# EAGLE design R2020Interface-RS485 (EAGLE 6.3)
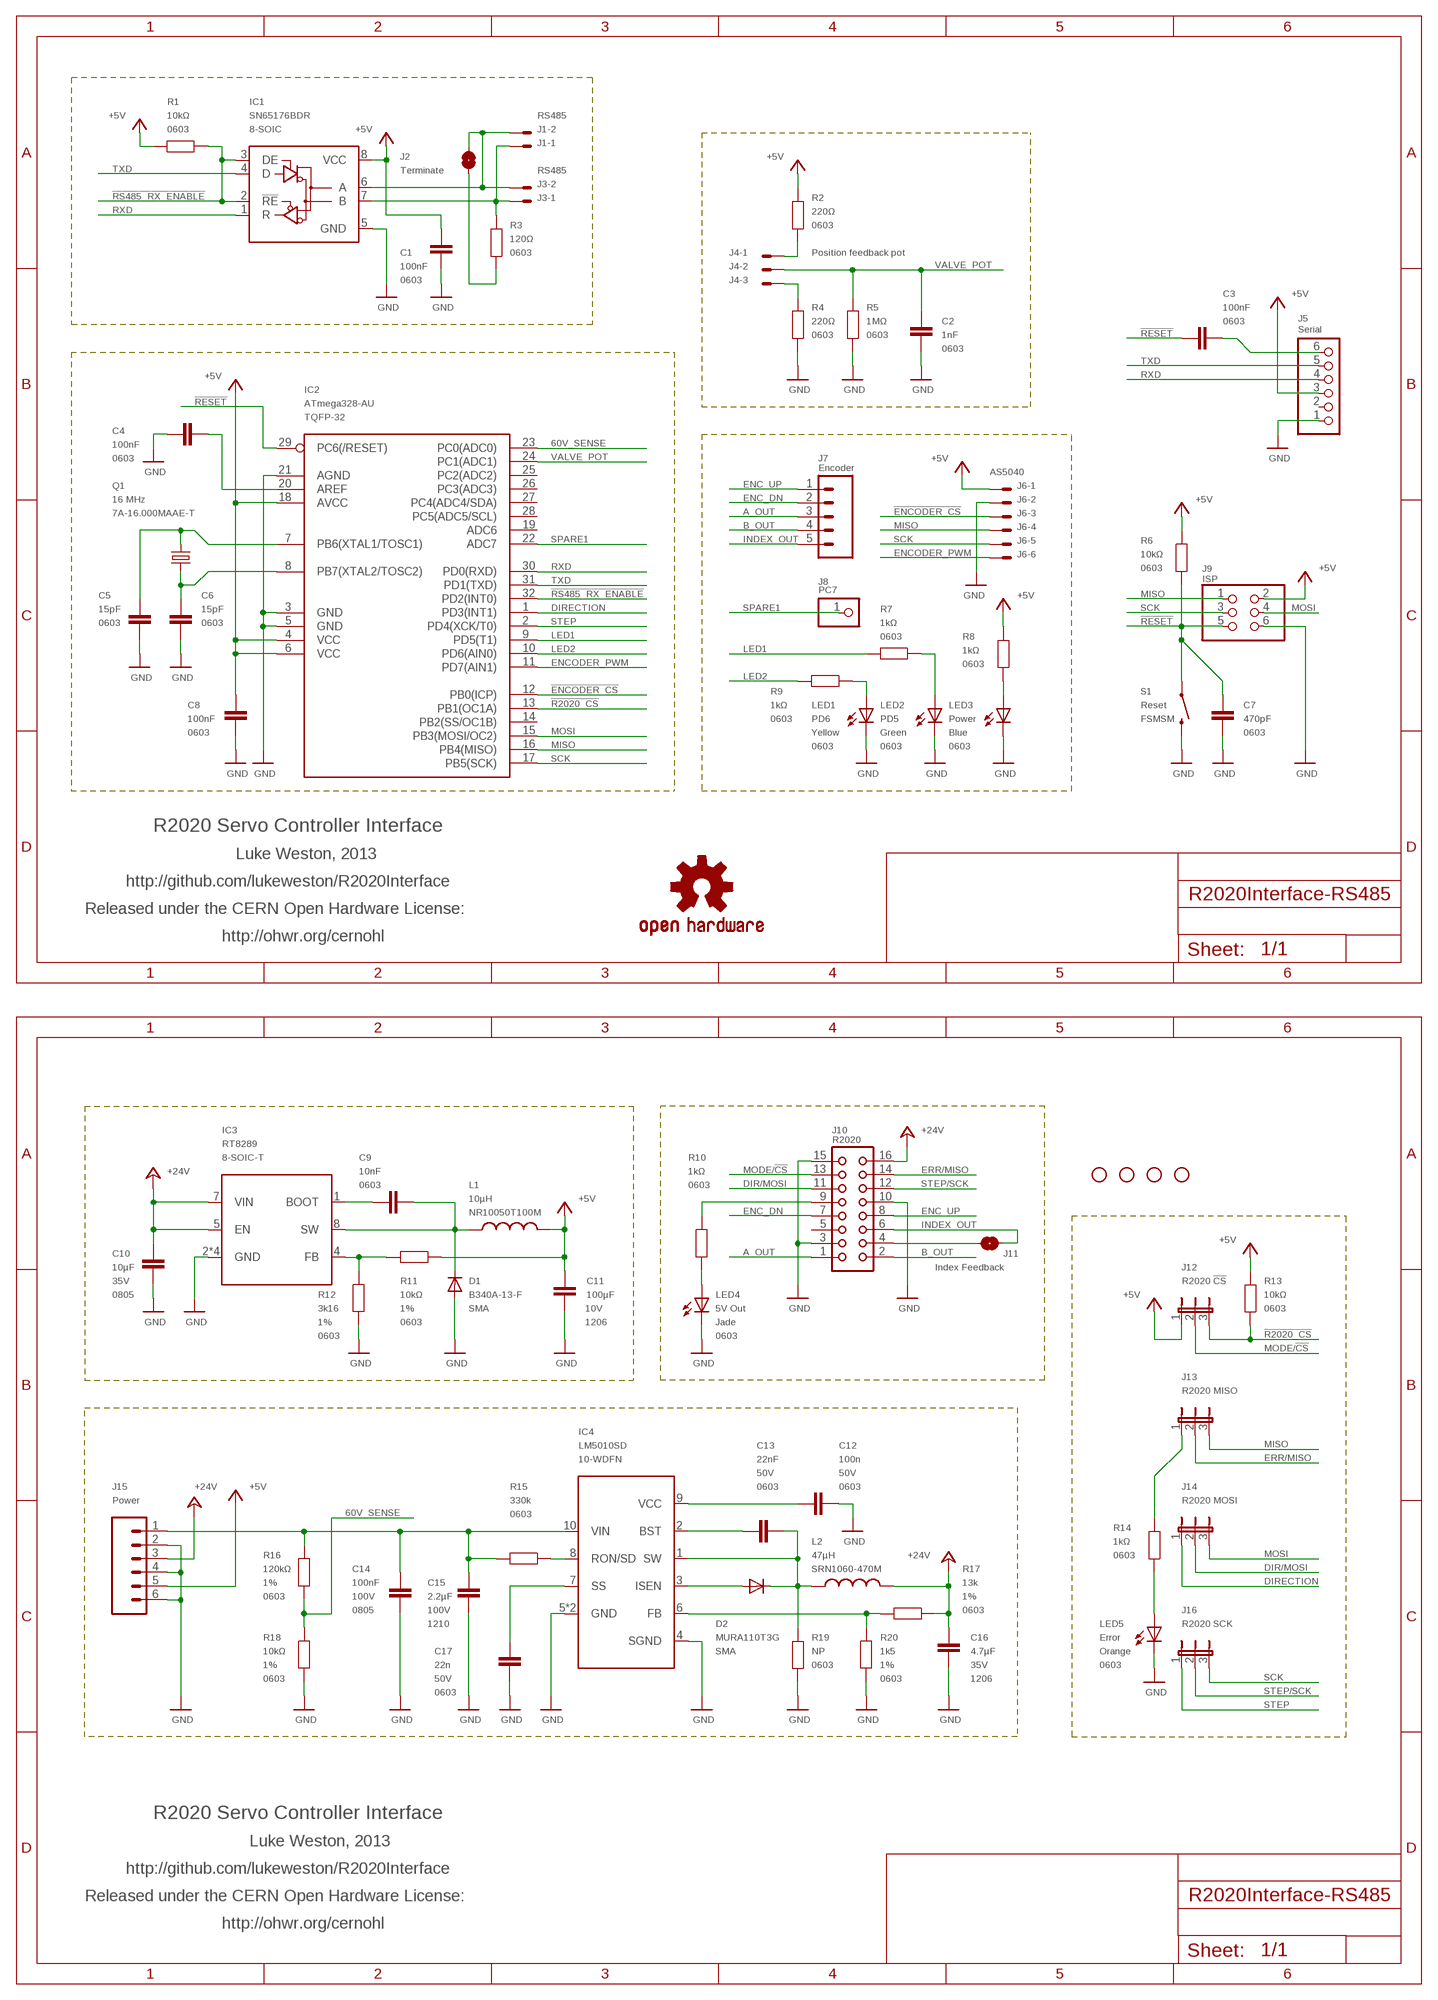
[diagram p0: schematic, sheet 1]

## Parts
C1  100nF  CAP0603  [0603]
C2  1nF  CAP0603  [0603]
C3  100nF  CAP0603  [0603]
C4  100nF  CAP0603  [0603]
C5  15pF  CAP0603  [0603]
C6  15pF  CAP0603  [0603]
C7  470pF  CAP0603  [0603]
C8  100nF  CAP0603  [0603]
C9  10nF  CAP0603  [0603]
C10  10µF  CAP0805  [0805]
C11  100µF  C-EUC1206K  [C1206K]
C12  100n  CAP0603  [0603]
C13  22nF  CAP0603  [0603]
C14  100nF  CAP0805  [0805]
C15  2.2µF  C-EUC1210K  [C1210K]
C16  4.7µF  C-EUC1206K  [C1206K]
C17  22n  CAP0603  [0603]
D1  B340A-13-F  DIODESMA  [SMA-DIODE]
D2  MURA110T3G  DIODESMA  [SMA-DIODE]
IC1  SN65176BDR  75176AD  [D_R-PDSO-G8]
IC2  ATmega328-AU  AVR-MEGA8-AI  [TQFP32-08]
IC3  RT8289  [SO08T]
IC4  LM5010SD  LM5010  [10-WSON]
J1  RS485  22-05-7028-02  [7395-02]
J2  Terminate  SJ  [SJ]
J3  RS485  22-05-7028-02  [7395-02]
J4  Position feedback pot  22-05-7038-03  [7395-03]
J5  Serial  PINHD-1X6  [1X06]
J6  AS5040  22-05-7068-06  [7395-06]
J7  Encoder  M05PTH  [1X05]
J8  PC7  PINHD-1X1  [1X01]
J9  ISP  PINHD-2X3  [2X03]
J10  R2020  CON16  [CON16]
J11  Index Feedback  SJ  [SJ]
J12  R2020 !CS  JP2E  [JP2]
J13  R2020 MISO  JP2E  [JP2]
J14  R2020 MOSI  JP2E  [JP2]
J15  Power  M06  [TERMINALBLOCK_3.5MM_6]
J16  R2020 SCK  JP2E  [JP2]
JP1  STAND-OFF  [STAND-OFF]
JP2  STAND-OFF  [STAND-OFF]
JP3  STAND-OFF  [STAND-OFF]
JP4  STAND-OFF  [STAND-OFF]
L1  10µH  NR10050  [NR10050]
L2  47µH  SRN1060  [SRN1060]
LED1  PD6  LED0603  [LED-0603]
LED2  PD5  LED0603  [LED-0603]
LED3  Power  LED0603  [LED-0603]
LED4  5V Out  LED0603  [LED-0603]
LED5  Error  LED0603  [LED-0603]
Q1  16 MHz  CRYSTAL-2LEAD3.2X5  [CRYSTAL-3.2X5MM]
R1  10kΩ  RESISTOR0603  [0603]
R2  220Ω  RESISTOR0603  [0603]
R3  120Ω  RESISTOR0603  [0603]
R4  220Ω  RESISTOR0603  [0603]
R5  1MΩ  RESISTOR0603  [0603]
R6  10kΩ  RESISTOR0603  [0603]
R7  1kΩ  RESISTOR0603  [0603]
R8  1kΩ  RESISTOR0603  [0603]
R9  1kΩ  RESISTOR0603  [0603]
R10  1kΩ  RESISTOR0603  [0603]
R11  10kΩ  RESISTOR0603  [0603]
R12  3k16  RESISTOR0603  [0603]
R13  10kΩ  RESISTOR0603  [0603]
R14  1kΩ  RESISTOR0603  [0603]
R15  330k  RESISTOR0603  [0603]
R16  120kΩ  RESISTOR0603  [0603]
R17  13k  RESISTOR0603  [0603]
R18  10kΩ  RESISTOR0603  [0603]
R19  NP  RESISTOR0603  [0603]
R20  1k5  RESISTOR0603  [0603]
S1  Reset  FSMSM  [FSMSM]
SY1  OSHW-LOGOS  [OSHW-LOGO-S]

## Nets
60V_SENSE: IC2.23(PC0(ADC0)) R16.1 R18.2
!ENCODER_CS: IC2.12(PB0(ICP)) J6.3
!R2020_CS: IC2.13(PB1(OC1A)) J12.3 R13.2
!RESET: C3.1 C7.2 IC2.29(PC6(/RESET)) J9.5 R6.1 S1.1
!RS485_RX_ENABLE: IC1.2(!RE) IC1.3(DE) IC2.32(PD2(INT0)) R1.2
+5V: C1.2 C8.1 C11.1 IC1.8(VCC) IC2.4(VCC) IC2.6(VCC) IC2.18(AVCC) J5.3 J6.1 J9.2 J12.1 J15.5 L1.2 R1.1 R2.1 R6.2 R8.1 R11.1 R13.1
+24V: C10.2 C16.1 IC3.5(EN) IC3.7(VIN) J10.16 J15.3 L2.2 R17.1
A_OUT: J7.3 J10.1
B_OUT: J7.4 J10.2
DIR/MOSI: J10.11 J14.2
DIRECTION: IC2.1(PD3(INT1)) J14.1
ENC_DN: J7.2 J10.7
ENC_UP: J7.1 J10.8
ENCODER_PWM: IC2.11(PD7(AIN1)) J6.6
ERR/MISO: J10.14 J13.2
GND: C1.1 C2.1 C4.2 C5.1 C6.1 C7.1 C8.2 C10.1 C11.2 C12.1 C14.1 C15.2 C16.2 C17.1 D1.A IC1.5(GND) IC2.3(GND) IC2.5(GND) IC2.21(AGND) IC3.2(GND) IC3.3(GND) IC3.6(GND) IC3.PAD(GND) IC4.4(SGND) IC4.5(GND) IC4.PAD(GND) J5.1 J6.2 J9.6 J10.3 J10.10 J10.15 J15.2 J15.4 J15.6 LED1.C LED2.C LED3.C LED4.C LED5.C R4.2 R5.2 R12.1 R18.1 R19.2 R20.1 S1.2
INDEX_IN: J10.4 J11.2
INDEX_OUT: J7.5 J10.6 J11.1
LED1: IC2.9(PD5(T1)) R7.2
LED2: IC2.10(PD6(AIN0)) R9.2
MISO: IC2.16(PB4(MISO)) J6.4 J9.1 J13.3
MODE/!CS: J10.13 J12.2
MOSI: IC2.15(PB3(MOSI/OC2)) J9.4 J14.3
N$1: C4.1 IC2.20(AREF)
N$2: C5.2 IC2.7(PB6(XTAL1/TOSC1)) Q1.1
N$3: C6.2 IC2.8(PB7(XTAL2/TOSC2)) Q1.2
N$4: LED4.A R10.1
N$5: J10.9 R10.2
N$6: J4.1 R2.2
N$7: J13.1 R14.1
N$8: IC1.6(A) J1.2 J2.2 J3.2
N$9: J4.3 R4.1
N$10: LED5.A R14.2
N$11: C9.1 D1.C IC3.8(SW) L1.1
N$12: IC1.7(B) J1.1 J3.1 R3.1
N$13: LED1.A R9.1
N$14: IC3.4(FB) R11.2 R12.2
N$15: LED2.A R7.1
N$16: C9.2 IC3.1(BOOT)
N$17: C13.1 D2.C IC4.1(SW) L2.1 R19.1
N$18: J2.1 R3.2
N$19: D2.A IC4.3(ISEN)
N$20: IC4.6(FB) R17.2 R20.2
N$21: C17.2 IC4.7(SS)
N$22: IC4.8(RON/SD) R15.1
N$25: C12.2 IC4.9(VCC)
N$26: C3.2 J5.6
N$27: C13.2 IC4.2(BST)
N$28: LED3.A R8.2
N$36: C14.2 C15.1 IC4.10(VIN) J15.1 R15.2 R16.2
RXD: IC1.1(R) IC2.30(PD0(RXD)) J5.4
SCK: IC2.17(PB5(SCK)) J6.5 J9.3 J16.3
SPARE1: IC2.22(ADC7) J8.1
STEP: IC2.2(PD4(XCK/T0)) J16.1
STEP/SCK: J10.12 J16.2
TXD: IC1.4(D) IC2.31(PD1(TXD)) J5.5
VALVE_POT: C2.2 IC2.24(PC1(ADC1)) J4.2 R5.1
Unconnected: IC2.14(PB2(SS/OC1B)) IC2.19(ADC6) IC2.25(PC2(ADC2)) IC2.26(PC3(ADC3)) IC2.27(PC4(ADC4/SDA)) IC2.28(PC5(ADC5/SCL)) J5.2 J10.5

## Notes on the sheet
- R2020 Servo Controller Interface
- Luke Weston, 2013
- http://github.com/lukeweston/R2020Interface
- Released under the CERN Open Hardware License:
- http://ohwr.org/cernohl
- R2020 Servo Controller Interface
- Luke Weston, 2013
- http://github.com/lukeweston/R2020Interface
- Released under the CERN Open Hardware License:
- http://ohwr.org/cernohl

## Library data of the parts
C1-C9 = freetronics-master-v1:CAP: Capacitor Standard 0603 ceramic capacitor, and 0.1" leaded capacitor.; PACKAGE: 0603
C10 = freetronics-master-v1:CAP: Capacitor Standard 0603 ceramic capacitor, and 0.1" leaded capacitor.; PACKAGE: 0805; VOLTAGE: 35V
C11 = rcl:C-EU: CAPACITOR, European symbol; PACKAGE: 1206; VOLTAGE: 10V
C12 C13 C17 = freetronics-master-v1:CAP: Capacitor Standard 0603 ceramic capacitor, and 0.1" leaded capacitor.; PACKAGE: 0603; VOLTAGE: 50V
C14 = freetronics-master-v1:CAP: Capacitor Standard 0603 ceramic capacitor, and 0.1" leaded capacitor.; PACKAGE: 0805; VOLTAGE: 100V
C15 = rcl:C-EU: CAPACITOR, European symbol; PACKAGE: 1210; VOLTAGE: 100V
C16 = rcl:C-EU: CAPACITOR, European symbol; PACKAGE: 1206; VOLTAGE: 35V
D1 D2 = freetronics-master-v1:DIODE: Diode These are standard reverse protection diodes and small signal diodes. SMA package can handle up to about 1A. SOD-323 can handle about 200mA. What the SOD-323 package when ordering, there are some mfgs out there that are 5-pin packages.; PACKAGE: SMA
IC1 = 751xx:75176A: DIFFERENTIAL BUS TRANSCEIVER Source: http://focus.ti.com/lit/ds/symlink/sn75176a.pdf; PACKAGE: 8-SOIC
IC2 = freetronics-master-v1:AVR-MEGA8: MICROCONTROLLER 8 Kbytes FLASH 1 kbytes SRAM 512 bytes EEPROM USART 6-channel 10 bit ADC 2-channel 8 bit ADC; PACKAGE: TQFP-32
IC3 = freetronics-luke:RT8289: RT8289 buck regulator; PACKAGE: 8-SOIC-T
IC4 = freetronics-luke:LM5010: Texas Instruments LM5010 high-voltage-input buck converter; PACKAGE: 10-WDFN
J1 J3 = con-molex:22-?-02: CONNECTOR wire to board 2.54 mm (.1 inch) pitch header; OC_FARNELL: 9731601; OC_NEWARK: unknown
J2 J11 = freetronics-luke:SJ: PCB "solder jumper". Note that there should nothing on the BOM corresponding to this "component".
J4 = con-molex:22-?-03: CONNECTOR wire to board 2.54 mm (.1 inch) pitch header; OC_FARNELL: unknown; OC_NEWARK: unknown
J5 = pinhead:PINHD-1X6: PIN HEADER
J6 = con-molex:22-?-06: CONNECTOR wire to board 2.54 mm (.1 inch) pitch header; OC_FARNELL: unknown; OC_NEWARK: unknown
J7 = freetronics-master-v1:M05: Header 5 Standard 5-pin 0.1" header. Use with straight break away headers (SKU : PRT-00116), right angle break away headers (PRT-00553), swiss pins (PRT-00743), machine pins (PRT-00117), and female headers (PRT-00115). Molex polarized connector foot print use with SKU : PRT-08230 with associated crimp pins and housings.
J8 = pinhead:PINHD-1X1: PIN HEADER
J9 = pinhead:PINHD-2X3: PIN HEADER
J10 = con-harting:CON16: CONNECTOR; OC_FARNELL: unknown; OC_NEWARK: unknown
J12-J14 J16 = jumper:JP2E: JUMPER
J15 = freetronics-master-v1:M06: Header 6 Standard 6-pin 0.1" header. Use with straight break away headers (SKU : PRT-00116), right angle break away headers (PRT-00553), swiss pins (PRT-00743), machine pins (PRT-00117), and female headers (PRT-00115). Molex polarized connector foot print use with SKU : PRT-08094 with associated crimp pins and housings. NOTES ON THE VARIANTS LOCK and LOCK_LONGPADS... This footprint was designed to help hold the alignment of a through-hole component (i.e. 6-pin header) while soldering it into place. You may notice that each hole has been shifted either up or down by 0.005 of an inch from it's more standard position (which is a perfectly straight line). This slight alteration caused the pins (the squares in the middle) to touch the edges of the holes. Because they are alternating, it causes a "brace" to hold the component in place. 0.005 has proven to be the perfect amount of "off-center" position when using our standard breakaway headers. Although looks a little odd when you look at the bare footprint, once you have a header in there, the alteration is very hard to notice. Also, if you push a header all the way into place, it is covered up entirely on the bottom side. This idea of altering the position of holes to aid alignment will be further integrated into the Sparkfun Library for other footprints. It can help hold any component with 3 or more connection pins.
JP1-JP4 = SparkFun:STAND-OFF: Stand Off This is the mechanical footprint for a #4 phillips button head screw. Use the keepout ring to avoid running the screw head into surrounding components. SKU : PRT-00447
L1 = freetronics-luke:NR10050: Taiyo Yuden NR10050 SMD power inductors; ID: NR10050T100M
L2 = freetronics-luke:SRN1060: Bourns SRN1060 series SMD power inductors; ID: SRN1060-470M
LED1 = freetronics-master-v1:LED: LEDs Standard schematic elements and footprints for 5mm, 3mm, 1206, and 0603 sized LEDs. 5mm - Spark Fun Electronics SKU : COM-00529 (and others); COLOR: Yellow; PACKAGE: 0603
LED2 = freetronics-master-v1:LED: LEDs Standard schematic elements and footprints for 5mm, 3mm, 1206, and 0603 sized LEDs. 5mm - Spark Fun Electronics SKU : COM-00529 (and others); COLOR: Green; PACKAGE: 0603
LED3 = freetronics-master-v1:LED: LEDs Standard schematic elements and footprints for 5mm, 3mm, 1206, and 0603 sized LEDs. 5mm - Spark Fun Electronics SKU : COM-00529 (and others); COLOR: Blue; PACKAGE: 0603
LED4 = freetronics-master-v1:LED: LEDs Standard schematic elements and footprints for 5mm, 3mm, 1206, and 0603 sized LEDs. 5mm - Spark Fun Electronics SKU : COM-00529 (and others); COLOR: Jade; PACKAGE: 0603
LED5 = freetronics-master-v1:LED: LEDs Standard schematic elements and footprints for 5mm, 3mm, 1206, and 0603 sized LEDs. 5mm - Spark Fun Electronics SKU : COM-00529 (and others); COLOR: Orange; PACKAGE: 0603
Q1 = freetronics-luke:CRYSTAL-2LEAD: 2-lead SMD crystal; ID: 7A-16.000MAAE-T
R1-R10 R13-R15 R19 = freetronics-master-v1:RESISTOR: Resistor Basic schematic elements and footprints for 0603, 1206, and PTH 1/10th watt (small) resistors.; PACKAGE: 0603
R11 R12 R16-R18 R20 = freetronics-master-v1:RESISTOR: Resistor Basic schematic elements and footprints for 0603, 1206, and PTH 1/10th watt (small) resistors.; PACKAGE: 0603; TOLERANCE: 1%
S1 = freetronics-luke:FSMSM: Tyco FSMSM 2-pin SMD small tactile button; PACKAGE: FSMSM
SY1 = SparkFun:OSHW-LOGO: Open Source Hardware Logo This logo indicates the piece of hardware it is found on incorporates a OSHW license and/or adheres to the definition of open source hardware found here: http://freedomdefined.org/OSHW

## Net classes
0 default: width 0.152 mm, drill 0.241 mm, clearance 0.152 mm

## Board
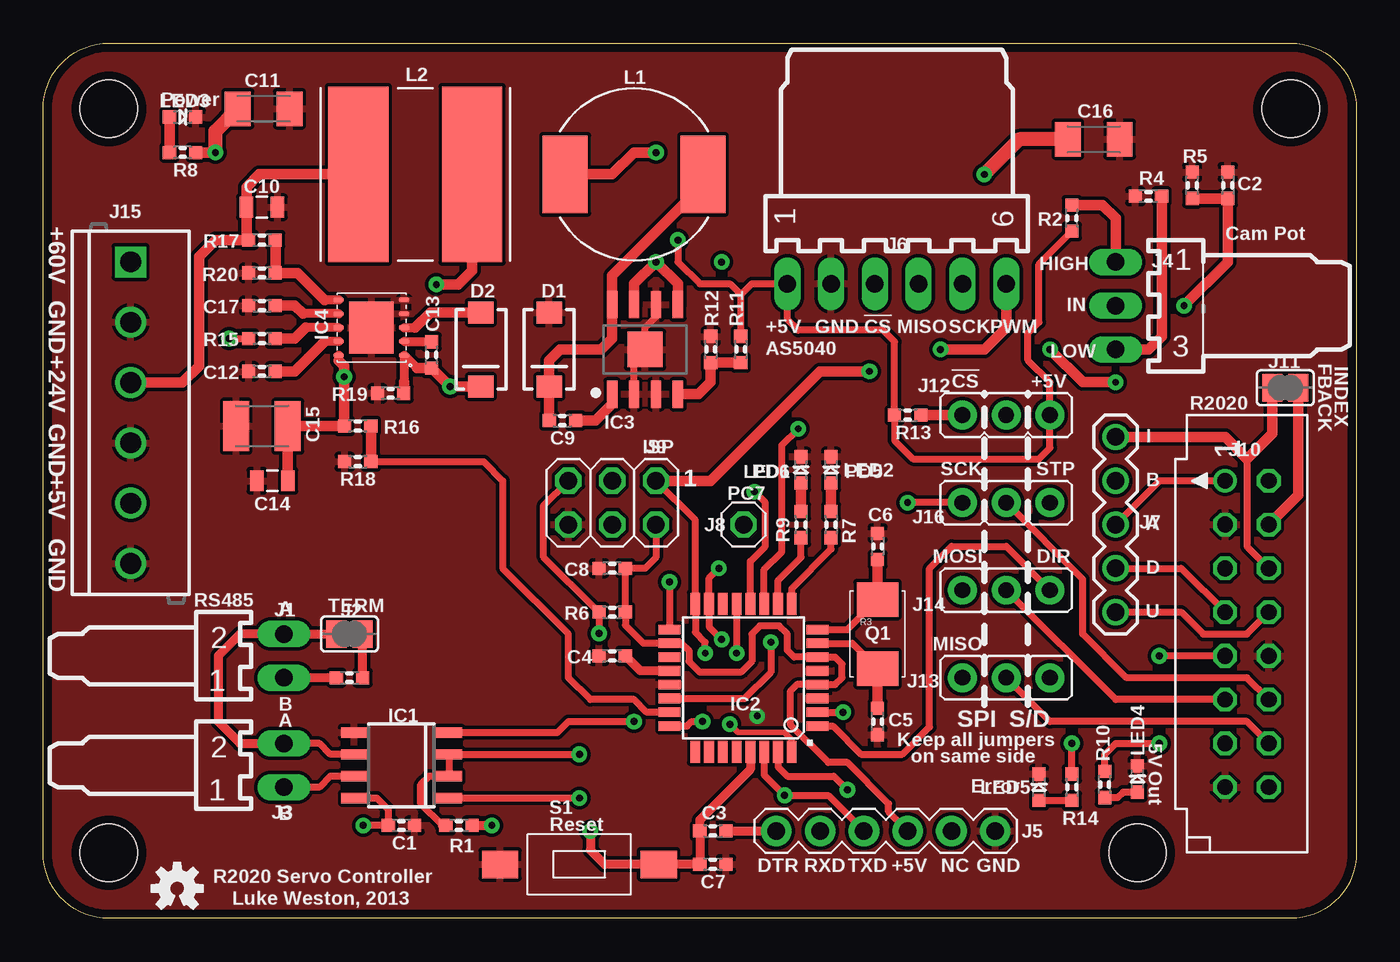
[diagram p1: board, top side]
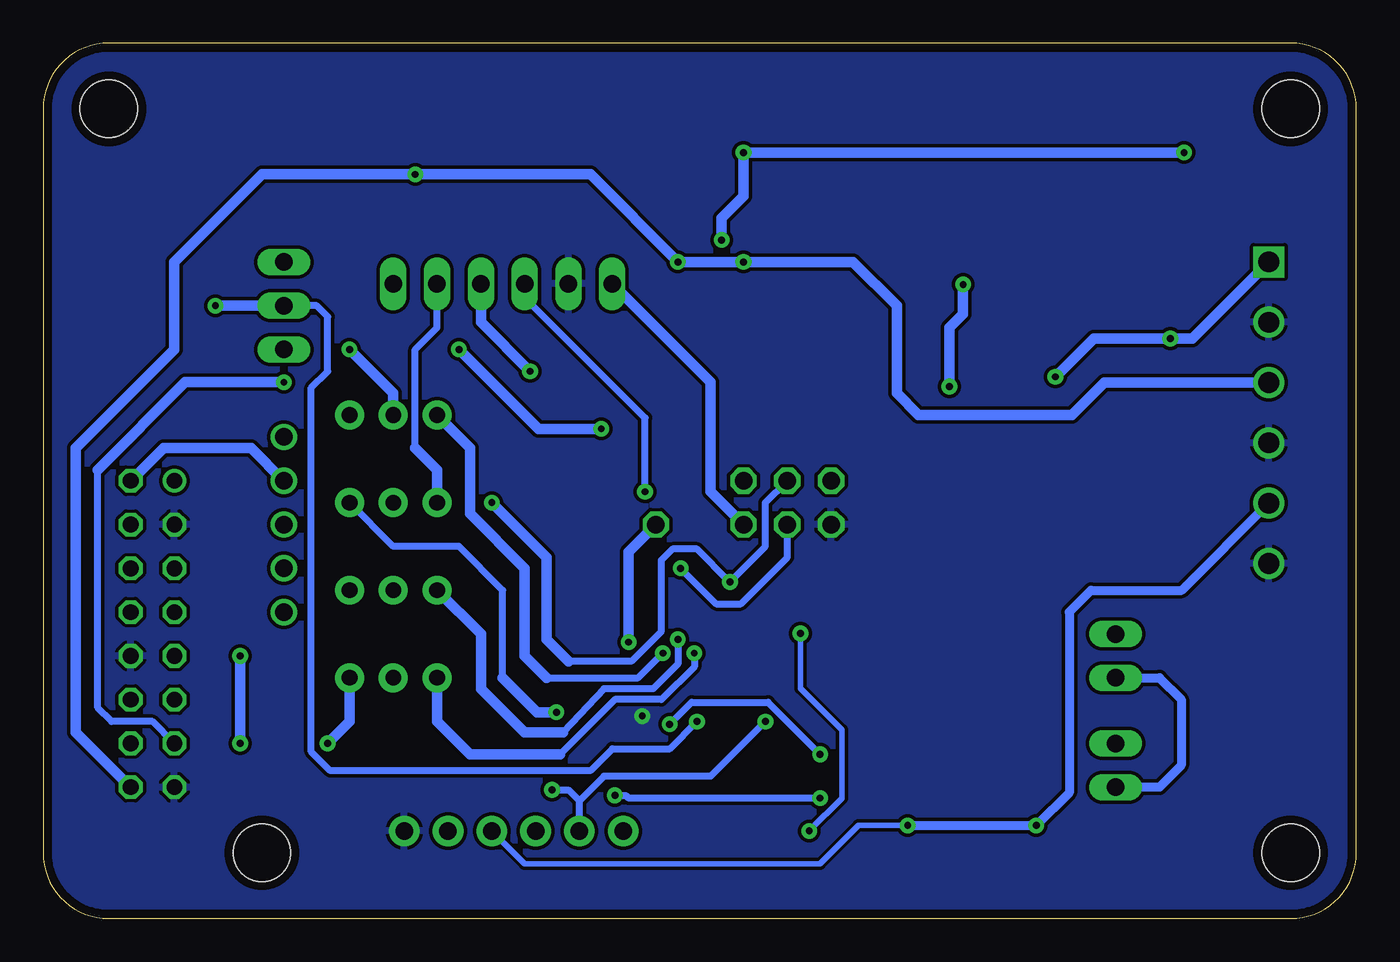
[diagram p2: board, bottom side, seen from below]

Size 76.2 x 50.8 mm. Coordinates in mm from the lower left corner, seen from the top.
Outline: 0,46.99 arc-90 3.81,50.8 72.39,50.8 arc-90 76.2,46.99 76.2,3.81 arc-90 72.39,0 3.81,0 arc-90 0,3.81 0,46.99
Copper layers (1*16): Top 0.035mm / dielectric 1.5mm / Bottom 0.035mm
Design rules "PCBCart-Standard *": minimum track width 8mil, minimum drill 0.4mm, track to track 8mil, track to pad 8mil, pad to pad 8mil, via to via 8mil, smd to smd 8mil, copper to edge 20mil, drill to drill 8mil, minimum pad ring 8mil, minimum via ring 10mil, stop-mask expansion 3mil, vias tented up to drill 16mil, thermal gap 8mil

### Footprints (pad centres in the part's own frame; a part is rotated, then mirrored left to right if it is on the bottom)
0603 = smd 0.762 x 0.762: 1 -0.762,0; 2 0.762,0
0805 = smd 0.8 x 1.2: 1 -0.9,0; 2 0.9,0
C1206K = smd 1.5 x 2: 1 -1.5,0; 2 1.5,0
C1210K = smd 1.5 x 2.9: 1 -1.5,0; 2 1.5,0
SMA-DIODE = smd 1.27 x 1.47: A -2.15,0; C 2.15,0
D_R-PDSO-G8 = smd 0.6 x 1.5: 1 -1.905,-2.75; 2 -0.635,-2.75; 3 0.635,-2.75; 4 1.905,-2.75; 5 1.905,2.75; 6 0.635,2.75; 7 -0.635,2.75; 8 -1.905,2.75
TQFP32-08 = smd 1.27 x 0.559: 1 -4.293,2.8; 2 -4.293,2; 3 -4.293,1.2; 4 -4.293,0.4; 5 -4.293,-0.4; 6 -4.293,-1.2; 7 -4.293,-2; 8 -4.293,-2.8; 17 4.293,-2.8; 18 4.293,-2; 19 4.293,-1.2; 20 4.293,-0.4; 21 4.293,0.4; 22 4.293,1.2; 23 4.293,2; 24 4.293,2.8 | smd 0.559 x 1.27: 9 -2.8,-4.293; 10 -2,-4.293; 11 -1.2,-4.293; 12 -0.4,-4.293; 13 0.4,-4.293; 14 1.2,-4.293; 15 2,-4.293; 16 2.8,-4.293; 25 2.8,4.293; 26 2,4.293; 27 1.2,4.293; 28 0.4,4.293; 29 -0.4,4.293; 30 -1.2,4.293; 31 -2,4.293; 32 -2.8,4.293
SO08T = smd 0.6 x 1.575: 1 -1.905,-2.6; 2 -0.635,-2.6; 3 0.635,-2.6; 4 1.905,-2.6; 5 1.905,2.6; 6 0.635,2.6; 7 -0.635,2.6; 8 -1.905,2.6 | smd 2.057 x 2.057: PAD 0,0
10-WSON = smd 0.3 x 0.6: 1 -1.6,-1.9; 2 -0.8,-1.9; 3 0,-1.9; 4 0.8,-1.9; 5 1.6,-1.9; 6 1.6,1.9; 7 0.8,1.9; 8 0,1.9; 9 -0.8,1.9; 10 -1.6,1.9 | smd 3 x 2.6: PAD 0,0
7395-02 = drill 1.016 long: 1 1.27,0; 2 -1.27,0
SJ = smd 1.168 x 1.6: 1 -0.762,0; 2 0.762,0
7395-03 = drill 1.016 long: 1 2.54,0; 2 0,0; 3 -2.54,0
1X06 = drill 1.016 pad 1.778: 1 -6.35,0; 2 -3.81,0; 3 -1.27,0; 4 1.27,0; 5 3.81,0; 6 6.35,0
7395-06 = drill 1.016 long: 1 6.35,0; 2 3.81,0; 3 1.27,0; 4 -1.27,0; 5 -3.81,0; 6 -6.35,0
1X05 = drill 1.016: 1 0,0; 2 2.54,0; 3 5.08,0; 4 7.62,0; 5 10.16,0
1X01 = drill 1.016 octagon: 1 0,0
2X03 = drill 1.016 octagon: 1 -2.54,-1.27; 2 -2.54,1.27; 3 0,-1.27; 4 0,1.27; 5 2.54,-1.27; 6 2.54,1.27
CON16 = drill 0.914: 1 -8.89,-1.27 | drill 0.914 octagon: 2 -8.89,1.27; 3 -6.35,-1.27; 4 -6.35,1.27; 5 -3.81,-1.27; 6 -3.81,1.27; 7 -1.27,-1.27; 8 -1.27,1.27; 9 1.27,-1.27; 10 1.27,1.27; 11 3.81,-1.27; 12 3.81,1.27; 13 6.35,-1.27; 14 6.35,1.27; 15 8.89,-1.27; 16 8.89,1.27
JP2 = drill 0.914 pad 1.676: 1 -2.54,0; 2 0,0; 3 2.54,0
TERMINALBLOCK_3.5MM_6 = drill 1.2 square: 1 0,0 | drill 1.2: 2 3.5,0; 3 7,0; 4 10.5,0; 5 14,0; 6 17.5,0
STAND-OFF = hole 3.302: 0,0
NR10050 = smd 2.6 x 4.5: 1 -4,0; 2 4,0
SRN1060 = smd 3.5 x 10.2: 1 -3.3,0; 2 3.3,0
LED-0603 = smd 0.762 x 0.762: A -0.762,0; C 0.762,0
CRYSTAL-3.2X5MM = smd 2 x 2.4: 1 -2,0; 2 2,0
FSMSM = smd 2.108 x 1.6: 1 -4.597,0; 2 4.597,0

### Placement (x,y rotation side)
C1  20.8,5.4 180 top
C2  68.74,42.55 270 top
C3  38.86,5.08 0 top
C4  33.02,15.24 180 top
C5  48.42,11.43 90 top
C6  48.42,21.59 270 top
C7  38.86,3.14 180 top
C8  33.02,20.32 180 top
C9  30.13,28.89 0 top
C10  12.7,41.27 180 top
C11  12.8,46.99 0 top
C12  12.7,31.75 0 top
C13  22.54,32.7 90 top
C14  13.31,25.4 0 top
C15  12.7,28.57 180 top
C16  60.96,45.21 0 top
C17  12.7,35.56 0 top
D1  29.37,33.02 270 top
D2  25.4,33.02 270 top
IC1  20.8,8.89 90 top
IC2  40.64,13.97 180 top
IC3  34.92,33.02 0 top
IC4  19.05,34.29 90 top
J1  13.97,15.24 270 top
J2  17.78,16.51 180 top
J3  13.97,8.89 270 top
J4  62.23,35.56 90 top
J5  48.9,5.08 180 top
J6  49.53,36.83 180 top
J7  62.23,17.78 90 top
J8  40.64,22.86 0 top
J9  33.02,24.13 180 top
J10  69.85,16.51 270 top
J11  72.07,30.8 0 top
J12  55.88,29.21 180 top
J13  55.88,13.97 180 top
J14  55.88,19.05 180 top
J15  5.08,38.1 270 top
J16  55.88,24.13 180 top
JP1  72.39,46.99 0 top
JP2  63.5,3.81 0 top
JP3  3.81,46.99 0 top
JP4  3.81,3.81 0 top
L1  34.29,43.18 180 top
L2  21.59,43.18 180 top
LED1  43.97,26.04 90 top
LED2  45.72,26.04 90 top
LED3  8.1,46.51 0 top
LED4  63.5,8.1 90 top
LED5  57.78,7.62 90 top
Q1  48.42,16.51 90 top
R1  24.13,5.4 180 top
R2  59.69,40.64 90 top
R3  17.78,13.97 0 top
R4  64.14,41.91 180 top
R5  66.67,42.55 90 top
R6  33.02,17.78 0 top
R7  45.72,22.86 270 top
R8  8.1,44.45 180 top
R9  43.97,22.86 270 top
R10  61.59,7.78 90 top
R11  40.48,33.02 270 top
R12  38.73,33.02 270 top
R13  50.16,29.21 0 top
R14  59.69,7.62 270 top
R15  12.7,33.66 180 top
R16  18.26,28.57 180 top
R17  12.7,39.37 0 top
R18  18.26,26.51 0 top
R19  20.16,30.48 180 top
R20  12.7,37.47 0 top
S1  31.11,3.14 180 top
SY1  7.78,1.75 0 top

### Tracks (layer width: path | path; a pad name or v marks a point on that pad's centre or on a via)
60V_SENSE
  Top 0.406: IC2.23 35.02,11.97 34.29,12.7 31.75,12.7 30.48,13.97 30.48,16.51 26.67,20.32 26.67,25.4 25.56,26.51 R18.2
  Top 0.61: R16.1 R18.2
!ENCODER_CS  (via drill 0.4)
  Top 0.406: IC2.12 41.04,20.72 41.91,21.59 41.91,24.13 v41.27,24.77
  Bottom 0.406: v41.27,24.77 41.27,29.05 48.26,36.04 J6.3
!R2020_CS  (via drill 0.4)
  Top 0.406: IC2.13 v40.24,15.4
  Top 0.61: R13.2 J12.3
  Bottom 0.406: 46.99,13.97 41.67,13.97 v40.24,15.4
  Bottom 0.61: J12.3 51.44,27.3 51.44,23.5 48.26,20.32 48.26,15.24 46.99,13.97
!RESET  (via drill 0.4)
  Top 0.406: v32.26,16.54 R6.1 32.26,17.91 32.1,17.91 29.05,20.95 29.05,23.97 J9.5
  Top 0.508: IC2.29 41.04,8.65 38.1,5.71 C3.1 C7.2 S1.1 32.58,3.14 31.75,3.97 v31.75,5.08
  Bottom 0.305: v32.26,16.54 32.26,13.37 29.84,10.95 29.84,6.99 v31.75,5.08
!RS485_RX_ENABLE  (via drill 0.4)
  Top 0.305: IC2.32 43.44,10.38 43.02,10.79 40.32,10.79 v39.85,11.27
  Top 0.406: 23.18,5.4 21.91,6.67 21.91,7.78 22.38,8.26 IC1.2 IC1.3 v31.11,9.53
  Top 0.508: R1.2 23.18,5.4
  Bottom 0.406: v39.85,11.27 38.58,12.54 34.13,12.54 v31.11,9.53
+5V  (via drill 0.4)
  Top 0.406: v36.83,39.37 36.83,38.1 38.1,36.83 39.85,36.83 40.48,36.2 | v35.56,44.45 | R11.1 40.48,36.2 | 40.48,36.2 41.12,36.83 J6.1 43.18,34.77 43.81,34.13 48.74,34.13 49.4,33.47 R13.1 49.4,27.75 50.48,26.67 57.78,26.67 58.42,27.3 J12.1 58.42,31.11 57.15,32.38 57.15,33.97 57.78,34.61 57.78,37.97 R2.1 | IC1.8 19.37,6.99 20.03,6.32 C1.2 v18.57,5.4 | J9.2 35.56,20.95 34.92,20.32 C8.1 R6.2 33.78,17.02 34.83,15.97 IC2.18 37.05,15.97 37.47,15.56 37.47,14.92 38.1,14.29 40.48,14.29 41.12,14.92 41.12,16.51 41.59,16.99 42.7,16.99 43.18,16.51 43.18,15.56 43.57,15.17 IC2.6 45.95,15.17 46.35,14.76 46.35,13.97 45.95,13.57 IC2.4 43.73,13.57 43.34,13.18 43.34,11.27 45.56,9.05 46.67,9.05 49.05,6.67 49.05,6.19 J5.3
  Top 0.508: R1.1 v26.04,5.4
  Top 0.61: v35.56,44.45 34.29,44.45 33.02,43.18 L1.2 | R8.1 v10,44.45
  Top 0.813: v10,44.45 10,45.7 C11.1
  Bottom 0.305: v26.04,5.4 28.89,5.4 31.11,3.17 48.26,3.17 J5.3
  Bottom 0.508: J15.5 10.13,19.05 15.4,19.05 16.67,17.78 16.67,7.3 v18.57,5.4 v26.04,5.4
  Bottom 0.61: J9.2 37.47,24.77 37.47,31.11 J6.1 | v36.83,39.37 36.83,40.64 35.56,41.91 v35.56,44.45 v10,44.45
+24V  (via drill 0.4)
  Top 0.61: IC3.7 34.29,36.83 v35.56,38.1 36.83,36.83 IC3.5 | J15.3 8.08,31.1 9.05,32.07 9.05,38.42 10,39.37 R17.1 11.8,39.51 C10.2 11.8,42.44 12.54,43.18 L2.2
  Top 0.813: C16.1 56.64,45.21 v54.61,43.18
  Bottom 0.61: J15.3 14.62,31.1 16.51,29.21 25.4,29.21 26.67,30.48 26.67,35.56 29.21,38.1 v35.56,38.1 v39.37,38.1 44.45,43.18 v54.61,43.18 63.5,43.18 68.58,38.1 68.58,33.02 74.3,27.3 74.3,10.79 J10.16
A_OUT
  Top 0.406: J10.1 64.77,25.4 J7.3
B_OUT
  Bottom 0.61: J7.4 64.14,27.3 69.22,27.3 J10.2
DIR/MOSI
  Top 0.406: J10.11 62.23,12.7 J14.2
DIRECTION
  Top 0.406: J14.1 55.88,21.59 52.7,21.59 51.44,20.32 51.44,11.11 49.85,9.53 47.47,9.53 45.82,11.17 IC2.1
ENC_DN
  Top 0.406: J7.2 66.04,20.32 J10.7
ENC_UP
  Top 0.406: J10.8 69.85,16.51 67.31,16.51 66.04,17.78 J7.1
ENCODER_PWM  (via drill 0.4)
  Top 0.406: IC2.11 41.84,20.25 42.86,21.27 42.86,27.46 v43.81,28.42
  Top 0.61: v52.07,33.02 54.61,33.02 55.88,34.29 J6.6
  Bottom 0.61: v43.81,28.42 47.47,28.42 v52.07,33.02
ERR/MISO
  Top 0.406: J10.14 69.85,11.43 58.42,11.43 J13.2
GND  (via drill 0.4)
  Top 0.406: IC3.6 35.56,34.92 34.92,34.29 IC3.PAD 34.29,32.38 IC3.2
  other vias: 41.43,11.75
  pour Top: -1.27,52.07 77.47,52.07 77.47,-1.27 -1.27,-1.27
  pour Bottom: -1.27,52.07 77.47,52.07 77.47,-1.27 -1.27,-1.27
INDEX_IN
  Top 0.61: J11.2 72.83,24.57 J10.4
INDEX_OUT
  Top 0.406: J10.6 69.85,21.59 69.85,26.67
  Top 0.61: J7.5 68.58,27.94 69.85,26.67 71.31,28.13 J11.1
LED1
  Top 0.406: IC2.9 43.44,19.15 45.72,21.43 R7.2
LED2
  Top 0.406: IC2.10 42.64,19.62 43.97,20.95 R9.2
MISO  (via drill 0.4)
  Top 0.406: v38.42,15.4 38.42,16.03 37.84,16.61 IC2.16 37.84,23.12 J9.1
  Top 0.61: J9.1 38.73,25.4 45.09,31.75 v47.94,31.75
  Bottom 0.406: 46.2,9.53 43.02,12.7 40.32,12.7 38.42,14.61 v38.42,15.4
  Bottom 0.61: 46.2,9.53 51.44,9.53 53.34,11.43 J13.3 | v47.94,31.75 50.8,34.61 J6.4
MODE/!CS  (via drill 0.4)
  Top 0.61: v62.23,31.11 60.33,31.11 v58.42,33.02
  Bottom 0.406: J10.13 69.85,11.43 72.23,11.43 73.03,12.22 73.03,26.04
  Bottom 0.61: 73.03,26.04 67.94,31.11 v62.23,31.11 | v58.42,33.02 55.88,30.48 J12.2
MOSI  (via drill 0.4)
  Top 0.406: v39.21,20.32 38.64,19.75 IC2.15 38.64,16.92 v39.37,16.19
  Bottom 0.406: v39.21,20.32 37.15,18.26 35.72,18.26 33.02,20.95 J9.4 | 46.04,10.79 43.66,13.34 40.8,13.34 39.37,14.76 v39.37,16.19
  Bottom 0.61: 46.04,10.79 48.26,10.79 50.8,13.34 50.8,16.51 J14.3
N$1
  Top 0.508: IC2.20 34.65,14.37 C4.1
N$2
  Top 0.406: IC2.7 46.96,15.97 Q1.1
  Top 0.61: C5.2 Q1.1
N$3
  Top 0.406: IC2.8 46.68,16.77 Q1.2
  Top 0.61: C6.2 Q1.2
N$4
  Top 0.406: LED4.A 62.67,7.33 62.36,7.02 R10.1
N$5  (via drill 0.4)
  Top 0.406: J10.9 v64.77,15.24 | R10.2 61.59,9.53 62.23,10.16 v64.77,10.16
  Bottom 0.61: v64.77,15.24 v64.77,10.16
N$6
  Top 0.61: R2.2 61.47,41.4 62.23,40.64 J4.1
N$7  (via drill 0.4)
  Top 0.406: R14.1 v59.69,10.16
  Bottom 0.61: v59.69,10.16 58.42,11.43 J13.1
N$8
  Top 0.406: IC1.6 16.67,9.53 16.03,10.16 J3.2
  Top 0.508: J3.2 11.43,10.16 10.16,11.43 10.16,15.24 11.43,16.51 J1.2 J2.2
N$9
  Top 0.61: R4.1 64.9,33.78 64.14,33.02 J4.3
N$10
  Top 0.406: LED5.A R14.2
N$11
  Top 0.406: C9.1
  Top 0.61: C9.1 D1.C 29.37,32.38 30,33.02 32.38,33.02 33.02,33.66 IC3.8 33.02,37.31 38.26,42.55 L1.1
N$12
  Top 0.406: IC1.7 16.67,8.26 16.03,7.62 J3.1
  Top 0.508: R3.1 J1.1
  Bottom 0.508: J1.1 11.43,13.97 10.16,12.7 10.16,8.89 11.43,7.62 J3.1
N$13
  Top 0.61: LED1.A R9.1
N$14
  Top 0.61: IC3.4 38.04,30.42 38.73,31.11 R12.2 R11.2
N$15
  Top 0.61: LED2.A R7.1
N$16
  Top 0.406: 33.02,29.84 IC3.1
  Top 0.61: C9.2 32.07,28.89 33.02,29.84
N$17  (via drill 0.4)
  Top 0.508: 21.7,31.94 IC4.1 20.95,31.14
  Top 0.61: 21.7,31.94 C13.1 v23.61,30.87 D2.C | 20.95,31.14 R19.1 | v22.82,36.79 24.09,36.79 24.89,37.59 L2.1
  Bottom 0.61: v23.61,30.87 23.61,34.29 22.82,35.08 v22.82,36.79
N$18
  Top 0.508: R3.2 J2.1
N$19
  Top 0.508: IC4.3 21.59,34.29
  Top 0.61: 21.59,34.29 22.47,35.17 D2.A
N$20
  Top 0.406: 13.49,37.5 R20.2 | 13.49,39.34 R17.2
  Top 0.508: IC4.6 16.34,35.89
  Top 0.61: 16.34,35.89 14.76,37.47 R20.2 | 13.49,37.5 13.49,39.34
N$21
  Top 0.508: IC4.7 15.07,35.09
  Top 0.61: 15.07,35.09 14.61,35.56 C17.2
N$22
  Top 0.508: IC4.8 15.24,34.29
  Top 0.61: 15.24,34.29 14.61,33.66 R15.1
N$25
  Top 0.508: IC4.9 16.34,33.49
  Top 0.61: 16.34,33.49 14.61,31.75 C12.2
N$26
  Top 0.508: C3.2 J5.6
N$27
  Top 0.508: IC4.2 22.52,33.49
  Top 0.61: 22.52,33.49 C13.2
N$28
  Top 0.61: R8.2 LED3.A
N$36  (via drill 0.4)
  Top 0.406: v10.79,33.66 R15.2 | 17.46,28.61 R16.2 | C14.2
  Top 0.508: IC4.10 17.15,32.38
  Top 0.61: 17.15,32.38 17.46,32.07 v17.46,31.43 17.46,28.61 | R16.2 C15.1 C14.2
  Bottom 0.61: v17.46,31.43 15.24,33.66 v10.79,33.66 9.53,33.66 J15.1
RXD  (via drill 0.4)
  Top 0.406: IC2.30 41.84,8.32 v43.02,7.14 45.56,7.14 J5.4 | v31.11,6.99 IC1.1
  Bottom 0.406: v31.11,6.99 42.23,6.99 42.39,7.14 v43.02,7.14
SCK  (via drill 0.4)
  Top 0.406: v36.35,19.53 IC2.17 | J16.3 v50.16,24.13
  Bottom 0.406: J9.3 34.29,24.13 34.29,21.59 v36.35,19.53 v36.35,19.54 36.37,19.54 38.26,21.43 39.69,21.43 40.32,20.8 40.32,16.67 42.07,14.92 45.72,14.92 | 54.61,27.3 54.61,33.02 53.34,34.29 J6.5
  Bottom 0.61: 45.72,14.92 46.99,16.19 46.99,20.95 v50.16,24.13 | J16.3 53.34,26.04 54.61,27.3
SPARE1  (via drill 0.4)
  Top 0.406: IC2.22 40.71,12.77 42.23,14.29 v42.23,16.03
  Bottom 0.61: v42.23,16.03 42.23,21.27 J8.1
STEP  (via drill 0.4)
  Top 0.406: IC2.2 v46.42,11.97
  Bottom 0.406: 49.53,13.97 49.53,19.05 52.07,21.59 55.88,21.59 J16.1
  Bottom 0.61: v46.42,11.97 47.53,11.97 49.53,13.97
STEP/SCK
  Top 0.406: J10.12 69.85,13.97 62.87,13.97 60.33,16.51 60.33,19.68 J16.2
TXD  (via drill 0.4)
  Top 0.406: IC2.31 42.64,8.79 43.18,8.26 45.88,8.26 v46.67,7.46 | IC1.4 29.84,10.79 30.48,11.43 v34.29,11.43
  Bottom 0.406: J5.5 45.09,6.83 | 45.09,6.83 45.72,7.46 v46.67,7.46 | v34.29,11.43 37.47,8.26 43.66,8.26 45.09,6.83
VALVE_POT  (via drill 0.4)
  Top 0.406: IC2.24 37.36,11.17 37.62,11.43 v38.26,11.43
  Top 0.61: v66.2,35.56 68.74,38.1 C2.2 R5.1
  Bottom 0.406: J4.2 60.33,35.56 59.69,34.92 59.69,31.75 60.64,30.8 60.64,9.68 59.53,8.57 44.45,8.57 43.17,9.85 39.84,9.85 v38.26,11.43
  Bottom 0.61: J4.2 v66.2,35.56

### Text on the board
tPlace: Power | +60V | Cam Pot | HIGH | GND | IN | +5V | GND | !CS | MISO | SCK | PWM | +24V | AS5040 | LOW | FBACK | INDEX | !CS | +5V | R2020 | GND | I | ISP | +5V | PD6 | PD5 | SCK | STP | 1 | B | PC7 | A | GND | MOSI | DIR | D | RS485 | A | TERM | U | MISO | B | A | SPI | S/D | . | Keep all jumpers | 5V | on same side | Out | Error | B | Reset | DTR | RXD | TXD | +5V | NC | GND | R2020 Servo Controller | Luke Weston, 2013